# Altium schematic sheet PAGE2 - LED, RCV.SchDoc
size A3; DocumentNumber: 2; SheetNumber: 2; SheetTotal: 2
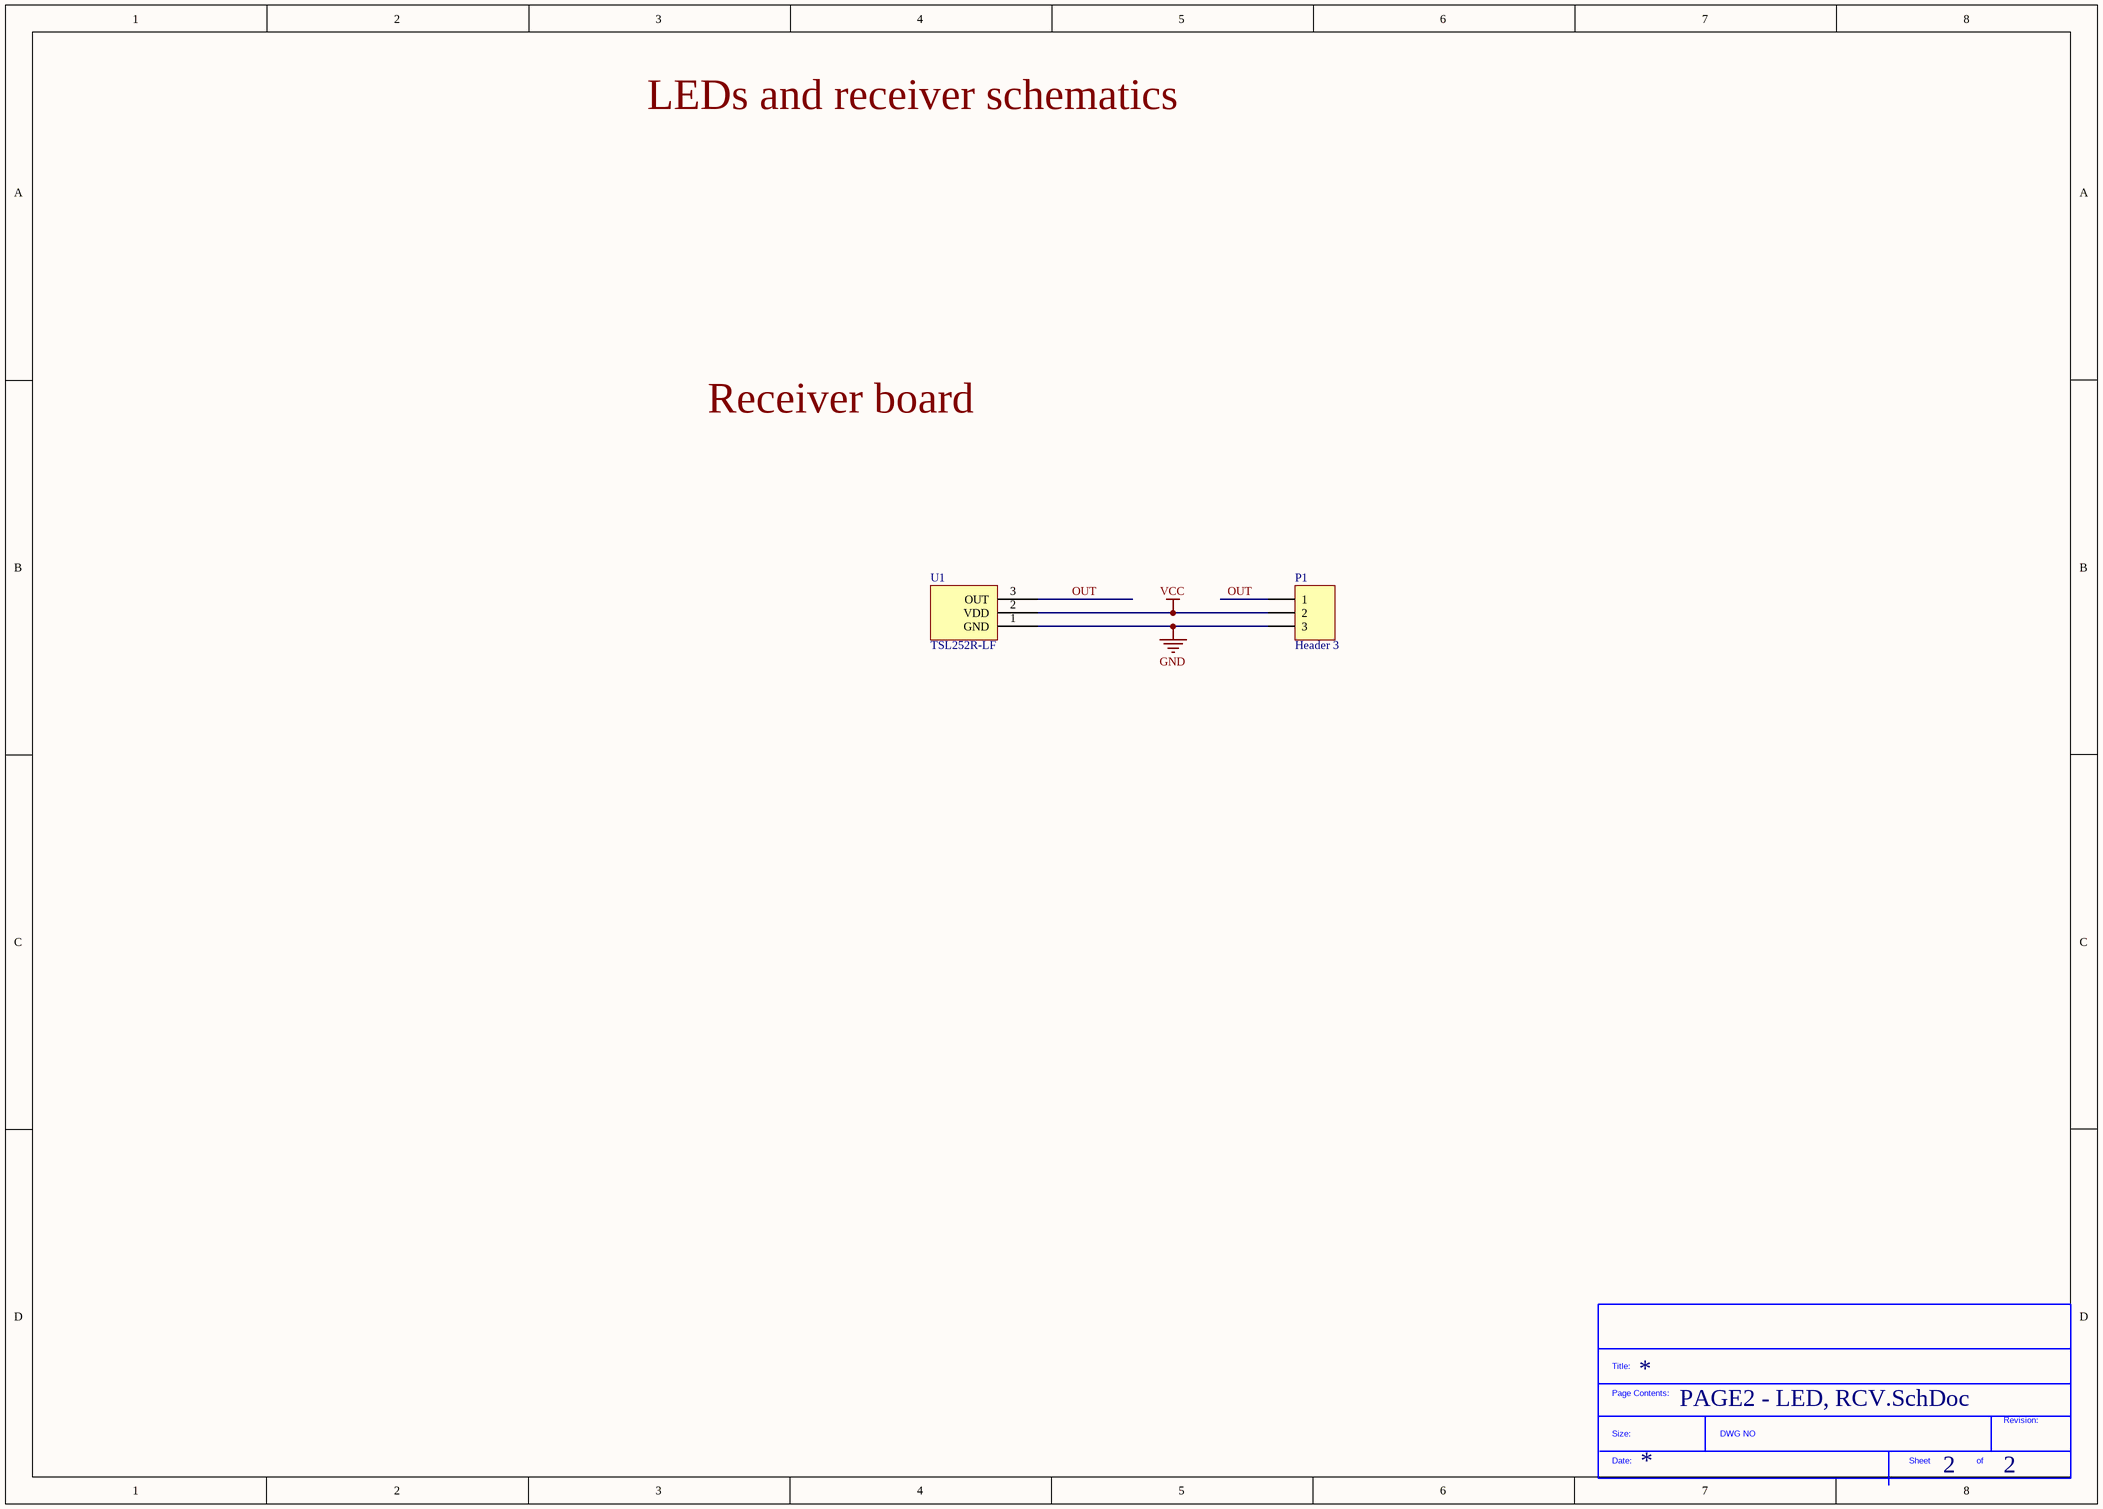
[diagram p0: PAGE2 - LED, RCV.SchDoc]

## Parts
*?  SDTitleBlock  (value not drawn)  (graphical)
P1  Header 3  [HDR1X3]
U1  TSL252R-LF  [LIGHT_RCV1]

## Nets
GND: P1.3 U1.1(GND)
VCC: P1.2 U1.2(VDD)
OUT: P1.1 U1.3(OUT)

## Notes on the sheet
- LEDs and receiver schematics
- Receiver board
- (in symbol SDTitleBlock) Title:; Page Contents:; Revision:; Size:; DWG NO; Date:; Sheet; of

## Library data of the parts
P1 = Header 3: Header, 3-Pin; LatestRevisionDate: 17-Jul-2002; LatestRevisionNote: Re-released for DXP Platform.; Publisher: Altium Limited
U1 = TSL252R-LF: AMS   TSL252R-LF   PHOTODIODE, SENSOR, L/VOLTS; Manufacturer: ams TAOS; Min Supply Voltage: 2.7V; Max Supply Voltage: 5.5V; Wavelength: 635nm; Output Current: 10mA; Output Type: Voltage; Lead Length: 14.8mm; Supplier 1: Mouser; Manufacturer Part Number: TSL252R-LF; Stock 1: 1918; Pricing 1: 1=2.83, 10=2.56, 50=1.96, 100=1.83, 1000=1.24, 10000=1.24 (USD); Case/Package: S; Number of Pins: 3; Min Operating Temperature: 0°C; Max Operating Temperature: 70°C; Packaging: Bulk; Package Quantity: 500; REACH SVHC: No SVHC; Lead Free: Lead Free; ComponentLink1URL: https://datasheet.ciiva.com/25650/tsl252r-lf-25650398.pdf; ComponentLink1Description: https://datasheet.ciiva.com/25650/tsl252r-lf-25650398.pdf; ComponentLink2URL: https://datasheet.ciiva.com/45465/tsl251r-datasheet-en-v1-45465110.pdf; ComponentLink2Description: https://datasheet.ciiva.com/45465/tsl251r-datasheet-en-v1-45465110.pdf; ComponentLink3URL: https://datasheet.ciiva.com/1316/301932-1316311.pdf; ComponentLink3Description: https://datasheet.ciiva.com/1316/301932-1316311.pdf; Supplier Part Number 1: 856-TSL252R-LF